# EAGLE design Qwiic_Mux_PCA9846 (EAGLE 9.6.2)
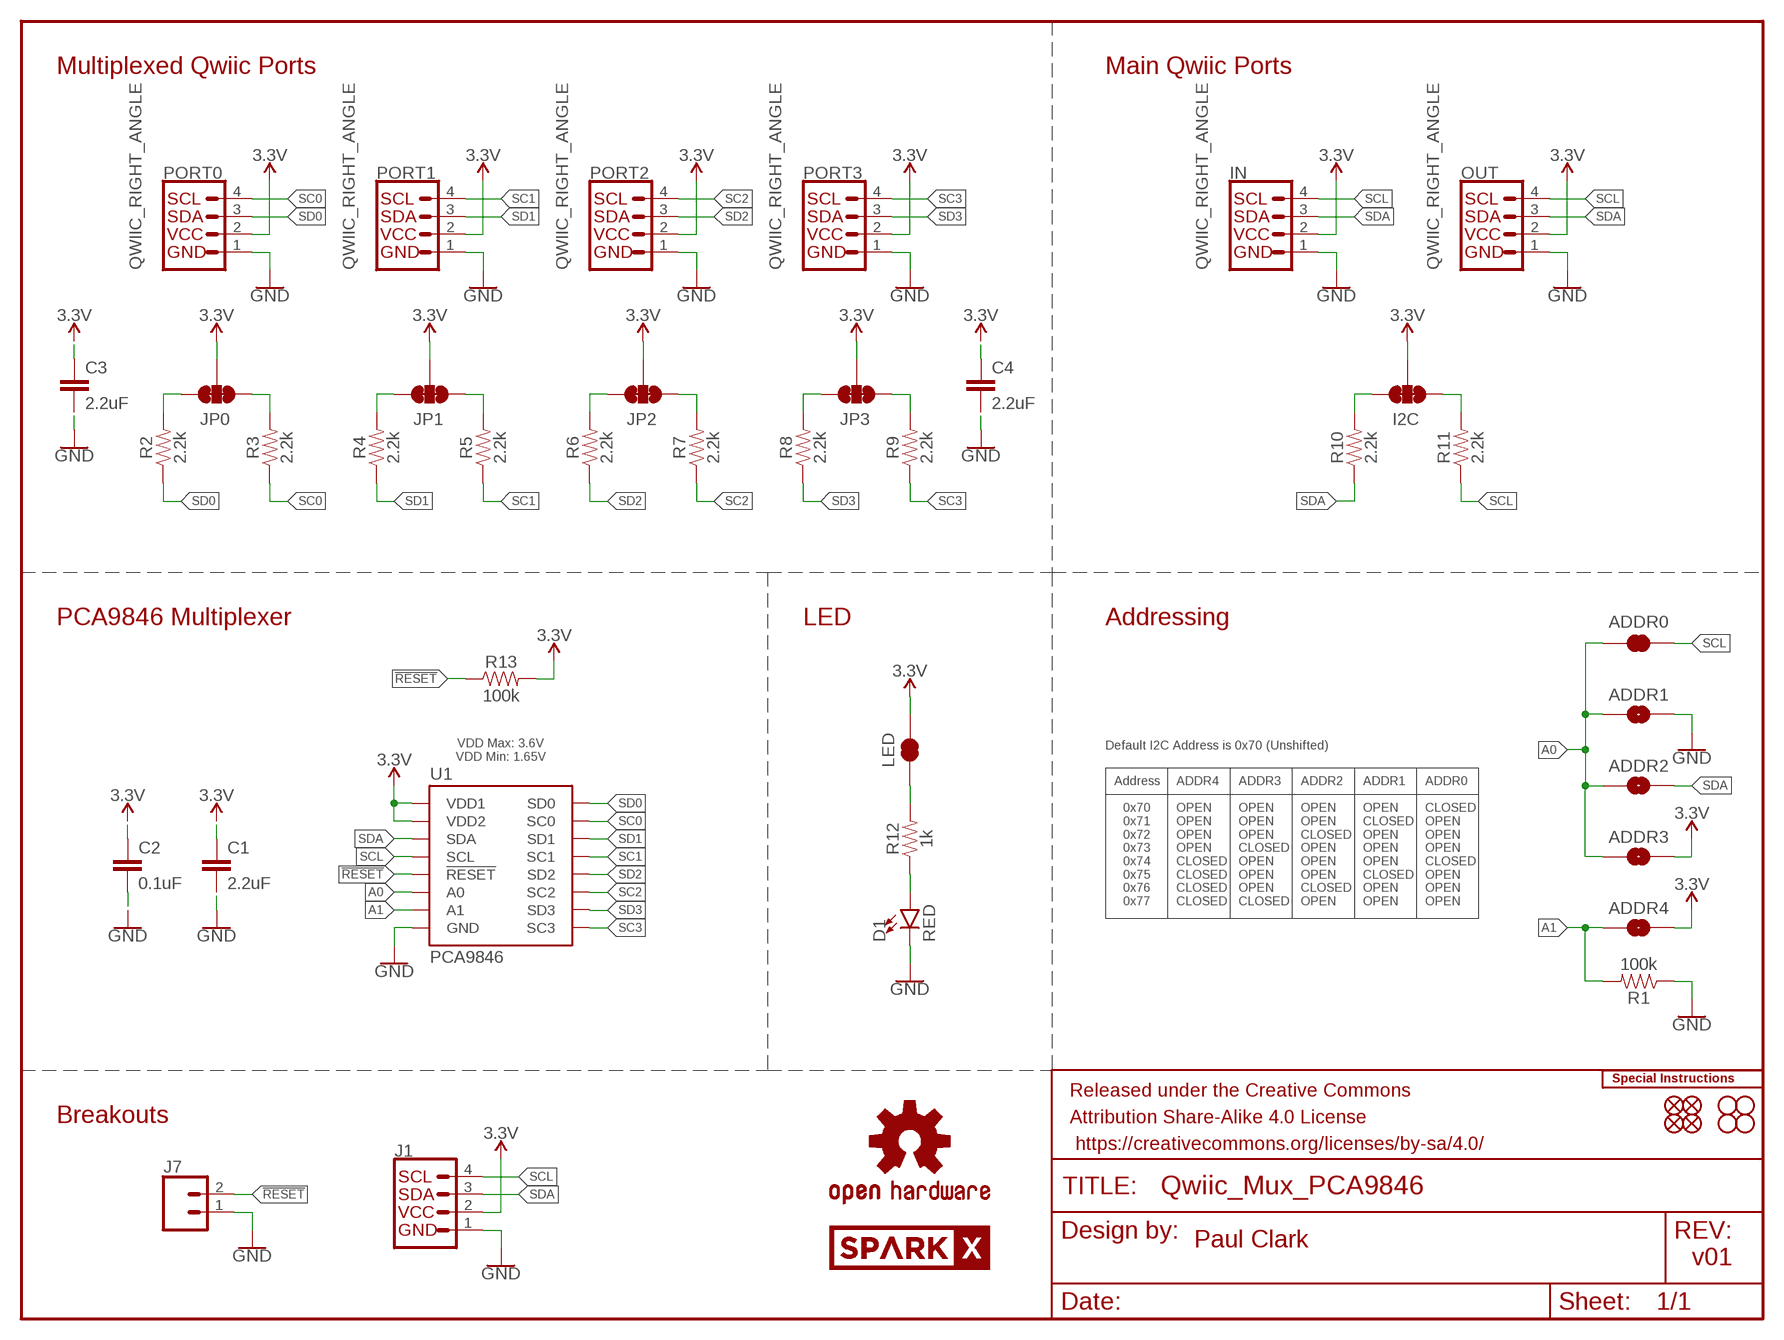
[diagram p0: schematic, sheet 1]

## Parts
ADDR0  JUMPER-SMT_2_NC_TRACE_SILK  [SMT-JUMPER_2_NC_TRACE_SILK]
ADDR1  JUMPER-SMT_2_NO_SILK  [SMT-JUMPER_2_NO_SILK]
ADDR2  JUMPER-SMT_2_NO_SILK  [SMT-JUMPER_2_NO_SILK]
ADDR3  JUMPER-SMT_2_NO_SILK  [SMT-JUMPER_2_NO_SILK]
ADDR4  JUMPER-SMT_2_NO_SILK  [SMT-JUMPER_2_NO_SILK]
C1  2.2uF  2.2UF-0402_TIGHT-10V-10%-X5R  [0402-TIGHT]
C2  0.1uF  0.1UF-0402T-6.3V-10%-X7R  [0402-TIGHT]
C3  2.2uF  2.2UF-0402_TIGHT-10V-10%-X5R  [0402-TIGHT]
C4  2.2uF  2.2UF-0402_TIGHT-10V-10%-X5R  [0402-TIGHT]
D1  RED  LED-RED0603  [LED-0603]
FD1  FIDUCIAL1X2  [FIDUCIAL-1X2]
FD2  FIDUCIAL1X2  [FIDUCIAL-1X2]
FD3  FIDUCIAL1X2  [FIDUCIAL-1X2]
FD4  FIDUCIAL1X2  [FIDUCIAL-1X2]
FRAME1  FRAME-LETTER  [CREATIVE_COMMONS]
H1  STAND-OFF  [STAND-OFF]
H2  STAND-OFF  [STAND-OFF]
H3  STAND-OFF  [STAND-OFF]
H4  STAND-OFF  [STAND-OFF]
I2C  JUMPER-SMT_3_2-NC_TRACE_SILK  [SMT-JUMPER_3_2-NC_TRACE_SILK]
IN  QWIIC_RIGHT_ANGLE  QWIIC_CONNECTORJS-1MM  [JST04_1MM_RA]
J1  I2C_STANDARD_NO_SILK  [1X04_NO_SILK]
J7  CONN_021X02_NO_SILK  [1X02_NO_SILK]
JP0  JUMPER-SMT_3_2-NC_TRACE_SILK  [SMT-JUMPER_3_2-NC_TRACE_SILK]
JP1  JUMPER-SMT_3_2-NC_TRACE_SILK  [SMT-JUMPER_3_2-NC_TRACE_SILK]
JP2  JUMPER-SMT_3_2-NC_TRACE_SILK  [SMT-JUMPER_3_2-NC_TRACE_SILK]
JP3  JUMPER-SMT_3_2-NC_TRACE_SILK  [SMT-JUMPER_3_2-NC_TRACE_SILK]
LED  JUMPER-SMT_2_NC_TRACE_SILK  [SMT-JUMPER_2_NC_TRACE_SILK]
LOGO1  SPECIAL_INSTRUCTIONS-ORDERING  [ORDERING_INSTRUCTIONS]
LOGO4  OSHW-LOGOMINI  [OSHW-LOGO-MINI]
OUT  QWIIC_RIGHT_ANGLE  QWIIC_CONNECTORJS-1MM  [JST04_1MM_RA]
PORT0  QWIIC_RIGHT_ANGLE  QWIIC_CONNECTORJS-1MM  [JST04_1MM_RA]
PORT1  QWIIC_RIGHT_ANGLE  QWIIC_CONNECTORJS-1MM  [JST04_1MM_RA]
PORT2  QWIIC_RIGHT_ANGLE  QWIIC_CONNECTORJS-1MM  [JST04_1MM_RA]
PORT3  QWIIC_RIGHT_ANGLE  QWIIC_CONNECTORJS-1MM  [JST04_1MM_RA]
R1  100k  100KOHM-0402T-1/16W-1%  [0402-TIGHT]
R2  2.2k  2.2KOHM-0402T-1/16W-1%  [0402-TIGHT]
R3  2.2k  2.2KOHM-0402T-1/16W-1%  [0402-TIGHT]
R4  2.2k  2.2KOHM-0402T-1/16W-1%  [0402-TIGHT]
R5  2.2k  2.2KOHM-0402T-1/16W-1%  [0402-TIGHT]
R6  2.2k  2.2KOHM-0402T-1/16W-1%  [0402-TIGHT]
R7  2.2k  2.2KOHM-0402T-1/16W-1%  [0402-TIGHT]
R8  2.2k  2.2KOHM-0402T-1/16W-1%  [0402-TIGHT]
R9  2.2k  2.2KOHM-0402T-1/16W-1%  [0402-TIGHT]
R10  2.2k  2.2KOHM-0402T-1/16W-1%  [0402-TIGHT]
R11  2.2k  2.2KOHM-0402T-1/16W-1%  [0402-TIGHT]
R12  1k  1KOHM-0402T-1/16W-1%  [0402-TIGHT]
R13  100k  100KOHM-0402T-1/16W-1%  [0402-TIGHT]
U1  PCA9846  [SOT403-1]
U$1  SPARKX-LOGO3  [SPARKX-SMALL]

## Nets
3.3V: ADDR3.2 ADDR4.2 C1.1 C2.1 C3.1 C4.1 I2C.2 IN.2 J1.2 JP0.2 JP1.2 JP2.2 JP3.2 LED.2 OUT.2 PORT0.2 PORT1.2 PORT2.2 PORT3.2 R13.2 U1.1(VDD1) U1.16(VDD2)
!RESET!: J7.2 R13.1 U1.3(!RESET)
A0: ADDR0.1 ADDR1.1 ADDR2.1 ADDR3.1 U1.2(A0)
A1: ADDR4.1 R1.2 U1.13(A1)
GND: ADDR1.2 C1.2 C2.2 C3.2 C4.2 D1.C IN.1 J1.1 J7.1 OUT.1 PORT0.1 PORT1.1 PORT2.1 PORT3.1 R1.1 U1.8(GND)
N$1: JP0.3 R2.2
N$2: JP0.1 R3.2
N$3: JP1.3 R4.2
N$4: JP1.1 R5.2
N$5: JP2.3 R6.2
N$6: JP2.1 R7.2
N$7: JP3.3 R8.2
N$8: JP3.1 R9.2
N$9: I2C.3 R10.2
N$10: I2C.1 R11.2
N$11: LED.1 R12.2
N$12: D1.A R12.1
SC0: PORT0.4 R3.1 U1.5(SC0)
SC1: PORT1.4 R5.1 U1.7(SC1)
SC2: PORT2.4 R7.1 U1.10(SC2)
SC3: PORT3.4 R9.1 U1.12(SC3)
SCL: ADDR0.2 IN.4 J1.4 OUT.4 R11.1 U1.14(SCL)
SD0: PORT0.3 R2.1 U1.4(SD0)
SD1: PORT1.3 R4.1 U1.6(SD1)
SD2: PORT2.3 R6.1 U1.9(SD2)
SD3: PORT3.3 R8.1 U1.11(SD3)
SDA: ADDR2.2 IN.3 J1.3 OUT.3 R10.1 U1.15(SDA)

## Notes on the sheet
- Multiplexed Qwiic Ports | Main Qwiic Ports
- PCA9846 Multiplexer | LED | Addressing
- VDD Max: 3.6V
  VDD Min: 1.65V
- Default I2C Address is 0x70 (Unshifted)
- Address | ADDR4 | ADDR3 | ADDR2 | ADDR1 | ADDR0
- 0x70
  0x71
  0x72
  0x73
  0x74
  0x75
  0x76
  0x77
- OPEN
  OPEN
  OPEN
  OPEN
  CLOSED
  CLOSED
  CLOSED
  CLOSED
- OPEN
  OPEN
  OPEN
  CLOSED
  OPEN
  OPEN
  OPEN
  CLOSED
- OPEN
  OPEN
  CLOSED
  OPEN
  OPEN
  OPEN
  CLOSED
  OPEN
- OPEN
  CLOSED
  OPEN
  OPEN
  OPEN
  CLOSED
  OPEN
  OPEN
- CLOSED
  OPEN
  OPEN
  OPEN
  CLOSED
  OPEN
  OPEN
  OPEN
- Breakouts
- Paul Clark
- v01

## Library data of the parts
ADDR0 LED = SparkFun-Jumpers:JUMPER-SMT_2_NC_TRACE: Normally closed trace jumper This jumper has a trace between two pads so it's normally closed (NC). Use a razor knife to open the connection. For best results follow the IPC guidelines for cutting traces: Cutout at least 0.063 mm (0.005 in). Remove all loose material to clean up the cut area. Seal the cut with an approved epoxy. Reapply solder to reclose the connection.
ADDR1-ADDR4 = SparkFun-Jumpers:JUMPER-SMT_2_NO: Normally open jumper This jumper has two pads in close proximity to each other. Apply solder to close the connection. Round pads are easier to solder for beginners, but are a lot larger. SparkFun Product that uses the round pads: SparkFun EL Sequencer <https://www.sparkfun.com/products/12781>
C1 C3 C4 = SparkFun-Capacitors:2.2UF: 2.2µF ceramic capacitors A capacitor is a passive two-terminal electrical component used to store electrical energy temporarily in an electric field.; PROD_ID: CAP-14232
C2 = SparkFun-Capacitors:0.1UF: 0.1µF ceramic capacitors A capacitor is a passive two-terminal electrical component used to store electrical energy temporarily in an electric field.; PROD_ID: CAP-14993
D1 = SparkFun-LED:LED-RED: Red SMD LED Used in manufacturing of most products at SparkFun Packages: 0603 - KB - KingBright (DIO-17976) SMD 0603 package [Datasheet] <https://www.kingbrightusa.com/images/catalog/SPEC/APT1608SURCK.pdf> 0603 - (DIO-00819, has gone EOL) SMD 0603 package 0603 SMART - SMD 0603 SMART package ( more efficient and expensive)[Product Link] <http://www.osram-os.com/Graphics/XPic2/00077099_0.pdf> 1206 - SMD1206 package [Product Link] <https://www.sparkfun.com/datasheets/DevTools/LilyPad/Q150OVS4.pdff> SparkFun Products: Pro Mini 328 -5V <https://www.sparkfun.com/products/821> RedBoard <https://www.sparkfun.com/products/12757> IOIO-OTG <https://www.sparkfun.com/products/13613>; PROD_ID: DIO-00819
FD1-FD4 = SparkFun-Aesthetics:FIDUCIAL: Fiducial Alignment Points Point-of-reference for pick-and-place machines and other optical instruments.
FRAME1 = SparkFun-Aesthetics:FRAME-LETTER: Schematic Frame - Letter Standard 8.5x11 US Letter frame
H1-H4 = SparkFun-Hardware:STAND-OFF: Stand Off Drill holes for mechanically mounting via screws, standoffs, etc. Note: Use the keepout ring to avoid running the screw head into surrounding components. Variant Overviews STAND-OFF - Mechanical footprint for a #4 phillips button head screw. STAND-OFF-TIGHT - Mechanical footprint for a #4 phillips button head screw, Example SparkFun Products Screw - Phillips Head (1/4", 4-40, 10 pack) <https://www.sparkfun.com/products/10453> (PRT-10453) Screw - Phillips Head (1/2", 4-40, 10 pack) <https://www.sparkfun.com/products/10452> (PRT-10452) Screw - Phillips Head (3/4", 4-40, 10 pack) <https://www.sparkfun.com/products/10451> (PRT-10451) Screw - Phillips Head (1", 4-40, 10 pack) <https://www.sparkfun.com/products/10450> (PRT-10450)
I2C JP0 JP1-JP3 = SparkFun-Jumpers:JUMPER-SMT_3_2-NC_TRACE: Normally closed trace jumper (2 of 2 connections) This jumper has a trace between all three pads so they are normally closed (NC). Use a razor knife to open the connection(s). For best results follow the IPC guidelines for cutting traces: Cutout at least 0.063 mm (0.005 in). Remove all loose material to clean up the cut area. Seal the cut with an approved epoxy. Reapply solder to reclose the connection(s).
IN OUT PORT0 PORT1-PORT3 = SparkFun-Connectors:QWIIC_CONNECTOR: SparkFun I2C Standard Qwiic Connector An SMD 1mm pitch JST connector makes it easy and quick (get it? Qwiic?) to connect I2C devices to each other. The Qwiic system <http://www.sparkfun.com/qwiic> enables fast and solderless connection between popular platforms and various sensors and actuators. We carry 200mm <https://www.sparkfun.com/products/14204>, 100mm <https://www.sparkfun.com/products/14205>, 50mm <https://www.sparkfun.com/products/14206>, and breadboard friendly <https://www.sparkfun.com/products/14207> Qwiic cables. We also offer 10 pcs strips <https://www.sparkfun.com/products/14323> the SMD connectors.; PROD_ID: CONN-13694
J1 = SparkFun-Connectors:I2C_STANDARD: SparkFun I2C Standard Pinout Header SparkFun has standardized on a pinout for all I2C based sensor breakouts. This pinout allows I2C boards to be plugged directly into the headers on Arduino Uno compatible boards, and to be daisy chained easily. Example SparkFun Products: SparkFun Atmospheric Sensor Breakout - BME280 <https://www.sparkfun.com/products/13676> SparkFun Altitude/Pressure Sensor Breakout - MPL3115A2 <https://www.sparkfun.com/products/11084> SparkFun TOF Range Finder Sensor - VL6180 <https://www.sparkfun.com/products/12785>
J7 = SparkFun-Connectors:CONN_02: Multi connection point. Often used as Generic Header-pin footprint for 0.1 inch spaced/style header connections On any of the 0.1 inch spaced packages, you can populate with these: Break Away Headers - Straight <https://www.sparkfun.com/products/116> (PRT-00116) Break Away Male Headers - Right Angle <https://www.sparkfun.com/products/553> (PRT-00553) Female Headers <https://www.sparkfun.com/products/115> (PRT-00115) Break Away Headers - Machine Pin <https://www.sparkfun.com/products/117> (PRT-00117) Break Away Female Headers - Swiss Machine Pin <https://www.sparkfun.com/products/743> (PRT-00743) For SCREWTERMINALS and SPRING TERMINALS visit here: Screw Terimnals on SparkFun.com <https://www.sparkfun.com/search/results?term=Screw+Terminals> (5mm/3.5mm/2.54mm spacing) This device is also useful as a general connection point to wire up your design to another part of your project. Our various solder wires solder well into these plated through hole pads. Hook-Up Wire - Assortment (Stranded, 22 AWG) <https://www.sparkfun.com/products/11375> (PRT-11375) Hook-Up Wire - Assortment (Solid Core, 22 AWG) <https://www.sparkfun.com/products/11367> (PRT-11367) View the entire wire category on our website here <https://www.sparkfun.com/categories/141> Special notes: Molex polarized connector foot print use with: PRT-08233 with associated crimp pins and housings. 2.54_SCREWTERM for use with PRT-10571. 3.5mm Screw Terminal footprints for PRT-08084 5mm Screw Terminal footprints for use with PRT-08432
LOGO1 = SparkFun-Aesthetics:SPECIAL_INSTRUCTIONS: Special Ordering/Production Instructions Alert Symbol for special PCB ordering instructions or unique production process warnings. Ordering Instructions Production Instructions Types of information that should be added to box: Copper weight Soldermask color Silk color PCB thickness Number of layers PCB Standard: 1.6mm FR4 1 oz copper immersion silver plating red soldermask white silkscreen Types of information that should be added to box: Special wash requirements Depaneling instructions Humidification Glue curing Default text settings: 0.07 inch 9% ratio 50% line distance
LOGO4 = SparkFun-Aesthetics:OSHW-LOGO: Open-Source Hardware (OSHW) Logo This logo indicates the piece of hardware it is found on incorporates a OSHW license and/or adheres to the definition of open source hardware found here: http://freedomdefined.org/OSHW
R1 R13 = SparkFun-Resistors:100KOHM: 100kΩ resistor A resistor is a passive two-terminal electrical component that implements electrical resistance as a circuit element. Resistors act to reduce current flow, and, at the same time, act to lower voltage levels within circuits. - Wikipedia; PROD_ID: RES-13495
R2-R11 = SparkFun-Resistors:2.2KOHM: 2.2kΩ resistor A resistor is a passive two-terminal electrical component that implements electrical resistance as a circuit element. Resistors act to reduce current flow, and, at the same time, act to lower voltage levels within circuits. - Wikipedia; PROD_ID: RES-14341
R12 = SparkFun-Resistors:1KOHM: 1kΩ resistor A resistor is a passive two-terminal electrical component that implements electrical resistance as a circuit element. Resistors act to reduce current flow, and, at the same time, act to lower voltage levels within circuits. - Wikipedia; PROD_ID: RES-14342
U1 = SparkFun-IC-Logic:PCA9846: NXP Semiconductors PCA9846 - I2C Multiplexer The PCA9846 device has four bidirectional translating switches that can be controlled through the I2C bus. The SCL/SDA upstream pair fans out to four downstream pairs, or channels. Any individual SCn/SDn channel or combination of channels can be selected, determined by the contents of the programmable control register. These downstream channels can be used to resolve I2C address conflicts.; PROD_ID: IC-18372
U$1 = SparkX:SPARKX-LOGO

## Board
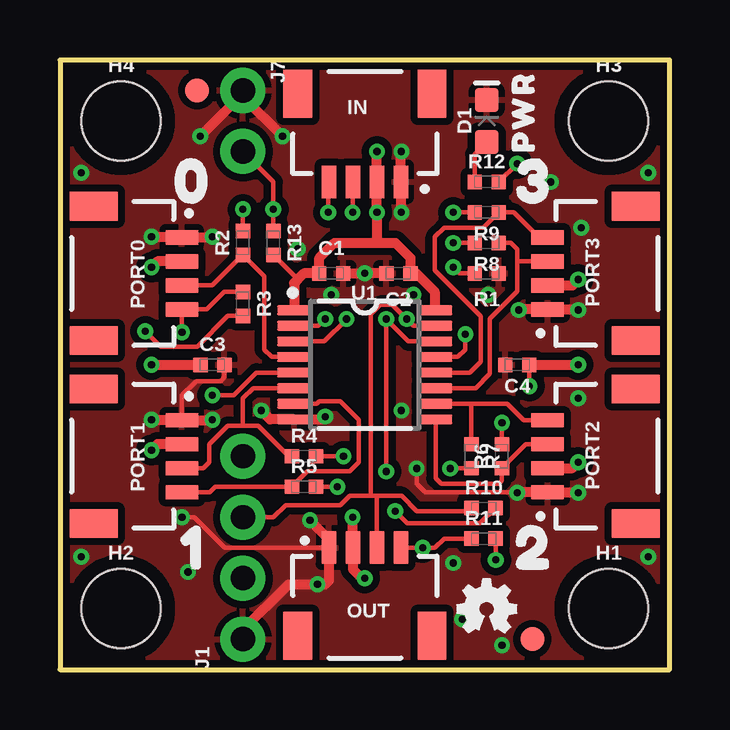
[diagram p1: board, top side]
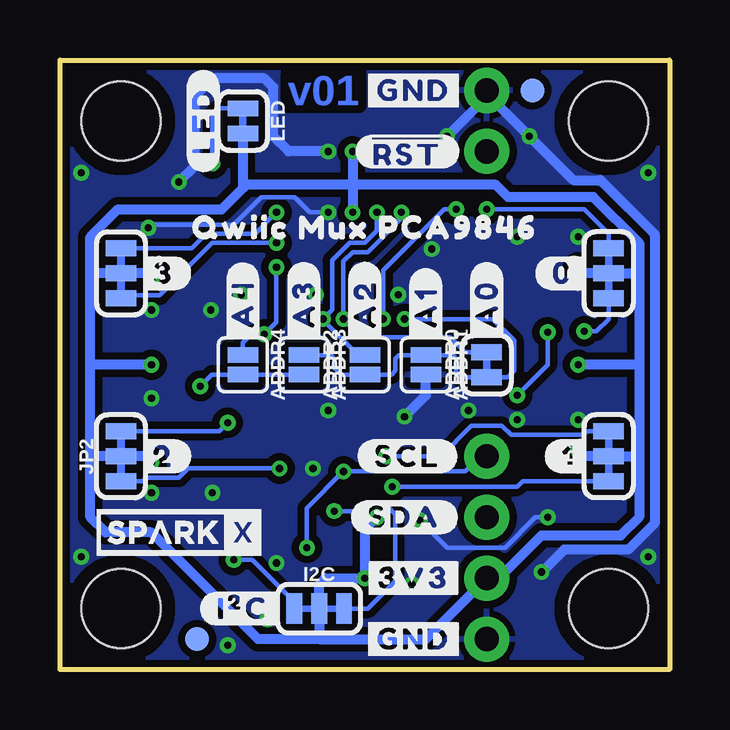
[diagram p2: board, bottom side, seen from below]

Size 25.4 x 25.4 mm. Coordinates in mm from the lower left corner, seen from the top.
Outline: 0,0 25.4,0 25.4,25.4 0,25.4 0,0
Copper layers (1*16): Top 0.035mm / dielectric 1.5mm / Bottom 0.035mm
Design rules "SparkFun-2-Layer-General-JLCPCB": minimum track width 7mil, minimum drill 0.3mm, track to track 7mil, track to pad 7mil, pad to pad 7mil, via to via 7mil, smd to smd 7mil, copper to edge 7mil, drill to drill 7mil, minimum pad ring 7mil, minimum via ring 7mil, stop-mask expansion 3mil, vias tented up to drill 25mil, thermal gap 10mil

### Footprints (pad centres in the part's own frame; a part is rotated, then mirrored left to right if it is on the bottom)
SMT-JUMPER_2_NC_TRACE_SILK = smd 0.66 x 1.27: 1 -0.521,0; 2 0.521,0
SMT-JUMPER_2_NO_SILK = smd 0.635 x 1.27: 1 -0.406,0; 2 0.406,0
0402-TIGHT = smd 0.6 x 0.6: 1 -0.5,0; 2 0.5,0
LED-0603 = smd 1 x 1: A -0.877,0; C 0.877,0
FIDUCIAL-1X2 = smd 1 x 1: 1 0,0
STAND-OFF = hole 3.302: 0,0
SMT-JUMPER_3_2-NC_TRACE_SILK = smd 0.66 x 1.27: 1 -1.041,0; 2 0,0; 3 1.041,0
JST04_1MM_RA = smd 0.6 x 1.35: 1 -1.5,0; 2 -0.5,0; 3 0.5,0; 4 1.5,0 | smd 1.2 x 2: NC1 2.8,-3.675; NC2 -2.8,-3.675
1X04_NO_SILK = drill 1.016 pad 1.88: 1 0,0; 2 2.54,0; 3 5.08,0; 4 7.62,0
1X02_NO_SILK = drill 1.016 pad 1.88: 1 0,0; 2 2.54,0
SOT403-1 = smd 0.4 x 1.4: 1 -2.275,-2.95; 2 -1.625,-2.95; 3 -0.975,-2.95; 4 -0.325,-2.95; 5 0.325,-2.95; 6 0.975,-2.95; 7 1.625,-2.95; 8 2.275,-2.95; 9 2.275,2.95; 10 1.625,2.95; 11 0.975,2.95; 12 0.325,2.95; 13 -0.325,2.95; 14 -0.975,2.95; 15 -1.625,2.95; 16 -2.275,2.95

### Placement (x,y rotation side)
ADDR0  7.62,12.7 90 bottom
ADDR1  10.16,12.7 270 bottom
ADDR2  12.7,12.7 90 bottom
ADDR3  15.24,12.7 270 bottom
ADDR4  17.78,12.7 270 bottom
C1  11.3,16.51 0 top
C2  14.1,16.51 180 top
C3  6.35,12.7 0 top
C4  19.05,12.7 180 top
D1  17.78,22.86 90 top
FD1  5.71,24.13 0 top
FD2  19.68,1.27 0 top
FD3  5.71,24.13 0 bottom
FD4  19.68,1.27 0 bottom
FRAME1  59.69,-13.97 0 top  (outside the outline)
H1  22.86,2.54 0 top
H2  2.54,2.54 0 top
H3  22.86,22.86 0 top
H4  2.54,22.86 0 top
I2C  14.61,2.54 0 bottom
IN  12.7,20.32 180 top
J1  7.62,1.27 90 top
J7  7.62,24.13 270 top
JP0  2.54,16.51 90 bottom
JP1  2.54,8.89 90 bottom
JP2  22.86,8.89 90 bottom
JP3  22.86,16.51 270 bottom
LED  17.78,22.86 270 bottom
LOGO1  36.83,46.99 0 top  (outside the outline)
LOGO4  17.78,2.54 0 top
OUT  12.7,5.08 0 top
PORT0  5.08,16.51 270 top
PORT1  5.08,8.89 270 top
PORT2  20.32,8.89 90 top
PORT3  20.32,16.51 90 top
R1  17.78,16.51 180 top
R2  7.62,17.78 90 top
R3  7.62,15.24 270 top
R4  10.16,8.89 0 top
R5  10.16,7.62 0 top
R6  18.41,8.89 90 top
R7  17.14,8.89 270 top
R8  17.78,17.78 180 top
R9  17.78,19.05 180 top
R10  17.65,6.73 0 top
R11  17.65,5.46 0 top
R12  17.78,20.32 0 top
R13  8.89,17.78 270 top
U1  12.7,12.7 270 top
U$1  20.45,5.71 0 bottom
U$2  [PWR43214]  19.3,23.24 90 top
U$3  [043215]  5.59,20.32 0 top
U$4  [10]  5.59,5.08 0 top
U$5  [211]  19.81,5.08 0 top
U$6  [3212]  19.81,20.32 0 top
U$7  [##RST##8]  10.92,21.59 0 bottom
U$8  [#0#9]  4.45,16.51 0 bottom
U$9  [#1#9]  4.19,8.89 0 bottom
U$10  [#2#9]  21.08,8.89 0 bottom
U$11  [#3#9]  21.08,16.51 0 bottom
U$12  [#3V3#7]  10.67,3.81 0 bottom
U$13  [#A0#0]  7.62,15.24 90 bottom
U$14  [#A1#1]  10.16,15.11 90 bottom
U$15  [#A2#2]  12.7,15.24 90 bottom
U$16  [#A3#3]  15.24,15.24 90 bottom
U$17  [#A4#4]  17.78,15.24 90 bottom
U$18  [#GND#7]  10.67,1.27 0 bottom
U$19  [#GND#7]  10.67,24.13 0 bottom
U$21  [#SCL#5]  10.92,8.89 0 bottom
U$22  [#SDA#6]  11.05,6.35 0 bottom
U$23  [#LED#0]  19.43,22.86 90 bottom
U$24  [QWIIC_MUX_PCA98461]  12.7,18.41 0 bottom
U$25  [#I�C#0]  17.78,2.54 0 bottom

### Tracks (layer width: path | path; a pad name or v marks a point on that pad's centre or on a via)
3.3V  (via drill 0.3)
  Top 0.178: v19.56,11.81 v19.55,11.82 C4.1 | R13.2 9.91,16.26
  Top 0.406: PORT0.2 4.06,17.01 v3.81,16.76 | PORT1.2 4.06,9.39 v3.81,9.14 | PORT2.2 21.34,8.39 v21.59,8.64 | PORT3.2 21.34,16.01 v21.59,16.26 | v12.19,6.35 v12.2,6.34 OUT.2 12.2,4.19 12.58,3.81 v12.7,3.81 | v13.21,21.59 v13.2,21.58 IN.2 v13.2,19.06 v13.21,19.05 13.21,17.78 | v3.81,12.7 C3.1 | C4.1 v21.59,12.7 | U1.1 9.75,16.1 9.91,16.26 10.16,16.51 C1.1 10.8,17.15 11.43,17.78 13.21,17.78 | U1.16 15.61,14.97 15.61,15.75 14.85,16.51 C2.1 14.6,17.15 13.97,17.78 13.21,17.78
  Bottom 0.178: ADDR3.2 ADDR4.2 19.07,12.29 v19.56,11.81
  Bottom 0.406: 14.61,1.27 I2C.2 14.61,3.56 14.35,3.81 v12.7,3.81 12.7,5.84 v12.19,6.35 | 14.61,1.27 10.16,1.27 J1.2 7.11,3.81 5.33,5.59 2.03,5.59 1.27,6.35 1.27,8.89 | 1.27,16.51 1.27,17.78 3.17,19.68 6.73,19.68 7.24,20.19 13.21,20.19 | 1.27,16.51 1.27,12.7 | 1.27,12.7 1.27,8.89 | v3.81,16.76 3.56,16.51 JP0.2 1.27,16.51 | v3.81,9.14 3.56,8.89 JP1.2 1.27,8.89 | 14.61,1.27 17.14,1.27 21.59,5.71 23.5,5.71 24.13,6.35 24.13,8.89 | v21.59,8.64 21.84,8.89 JP2.2 24.13,8.89 | 24.13,8.89 24.13,12.7 | 24.13,12.7 24.13,16.51 | 24.13,16.51 24.13,18.03 22.99,19.18 18.67,19.18 17.78,20.07 | v21.59,16.26 21.84,16.51 JP3.2 24.13,16.51 | v13.21,21.59 13.21,20.19 | 13.21,20.19 v13.21,19.05 | 13.21,20.19 17.65,20.19 17.78,20.07 | LED.2 17.78,20.07 | 1.27,12.7 v3.81,12.7 | v21.59,12.7 24.13,12.7
!RESET!  (via drill 0.3)
  Top 0.178: U1.3 11.01,13.68 v11.94,14.61 | J7.2 8.89,20.32 v8.89,19.18 R13.1
  Bottom 0.178: v11.94,14.61 11.94,16.64 9.4,19.18 v8.89,19.18
A0  (via drill 0.3)
  Top 0.178: v11.05,14.61 10.77,14.32 U1.2
  Bottom 0.178: ADDR3.1 14.12,13.11 13.97,12.95 13.97,12.57 13.69,12.29 ADDR2.1 11.58,12.29 11.43,12.45 11.43,12.95 11.28,13.11 ADDR1.1 9.04,13.11 8.89,12.95 8.89,12.32 8.75,12.18 ADDR0.1 6.74,12.18 6.48,12.45 6.48,13.72 7.37,14.61 v11.05,14.61
A1  (via drill 0.3)
  Top 0.178: U1.13 16.58,13.03 16.89,13.34 v16.89,13.97 | R1.2 16.64,16.51 v16.38,16.76
  Bottom 0.178: ADDR4.1 17.78,13.61 17.42,13.97 v16.89,13.97 16.38,14.48 v16.38,16.76
GND  (via drill 0.3)
  Top 0.178: PORT1.1 5.08,11.43 5.67,12.02 6.69,12.02 6.85,12.18 C3.2 | v5.08,6.35 5.59,6.35 6.86,5.08 OUT.1 | v14.86,8.38 14.86,7.75 15.21,7.39 19.07,7.39
  Top 0.406: v14.22,21.59 14.2,21.57 IN.1 14.2,19.07 v14.22,19.05 | v3.81,18.03 3.83,18.01 PORT0.1 6.33,18.01 v6.35,18.03 | v19.11,14.99 19.14,15.01 PORT3.1 21.57,15.01 v21.59,14.99 | v19.05,7.37 19.07,7.39 PORT2.1 21.57,7.39 v21.59,7.37 | v3.81,10.41 3.83,10.39 PORT1.1 6.33,10.39 v6.35,10.41 | v10.41,6.22 11.2,5.44 OUT.1 11.2,3.71 11.05,3.56 v10.73,3.56 9.53,3.56 7.62,1.65 J1.1 | v11.05,10.54 10.93,10.43 U1.8 8.75,10.43 v8.38,10.79 | C1.2 v12.7,16.51 C2.2 | v5.84,22.23 7.62,24 J7.1 7.62,23.88 v9.27,22.23
  Bottom 0.178: v5.08,6.35 5.59,6.35 6.86,5.08 9.27,5.08 v10.41,6.22 | v14.22,19.05 14.99,19.05 15.62,19.68 17.02,19.68 18.16,18.54 21.59,18.54 v21.72,18.41
  Bottom 0.406: v11.05,10.54 10.16,11.43 ADDR1.2 | v5.33,4.06 4.39,5 1.73,5 0.62,6.11 0.62,18.15 2.87,20.4 4.01,20.4 v5.84,22.23 7.62,24 J7.1 7.62,23.88 v9.27,22.23 | v14.22,21.59 15.88,21.59 16.51,22.23 16.51,24.26 16.89,24.64 19.05,24.64 19.81,23.88 19.81,20.95 v20.45,20.32
  other vias: 17.84,15.62 11.3,15.62 9.91,17.53 14.22,10.79 16.38,4.45 18.41,1.02 16.76,2.1 21.59,11.3 14.73,15.62 0.89,20.7 24.51,20.7 24.51,4.7 0.89,4.7
  pour Top (isolate 0.305): 0,25.4 0,0 25.4,0 25.4,25.4
  pour Bottom (isolate 0.305): 0,25.4 0,0 25.4,0 25.4,25.4
N$1  (via drill 0.3)
  Top 0.178: v7.62,19.18 R2.2
  Bottom 0.178: JP0.3 2.54,18.16 3.56,19.18 v7.62,19.18
N$2  (via drill 0.3)
  Top 0.178: R3.2 6.99,14.74 5.71,13.46 4.19,13.46 v3.56,14.1
  Bottom 0.178: v3.56,14.1 3.05,14.1 2.54,14.61 JP0.1
N$3  (via drill 0.3)
  Top 0.178: R4.2 v11.81,8.89
  Bottom 0.178: v11.81,8.89 9.53,8.89 8.26,10.16 6.99,10.16 6.6,9.78 3.6,9.78 3.45,9.93 JP1.3
N$4  (via drill 0.3)
  Top 0.178: R5.2 v11.56,7.62
  Bottom 0.178: v11.56,7.62 6.35,7.62 6.12,7.85 JP1.1
N$5  (via drill 0.3)
  Top 0.178: R6.2 v18.41,10.29
  Bottom 0.178: v18.41,10.29 18.77,9.93 JP2.3
N$6  (via drill 0.3)
  Top 0.178: R7.2 v16.26,8.39 v16.26,8.38
  Bottom 0.178: v16.26,8.38 20.07,8.38 20.45,8 21.8,8 21.95,7.85 JP2.1
N$7  (via drill 0.3)
  Top 0.178: R8.2 v16.38,17.78
  Bottom 0.178: JP3.3 22.73,15.6 21.23,15.6 19.05,17.78 v16.38,17.78
N$8  (via drill 0.3)
  Top 0.178: R9.2 v16.38,19.05
  Bottom 0.178: v16.38,19.05 17.27,18.16 19.3,18.16 19.91,17.55 JP3.1
N$9  (via drill 0.3)
  Top 0.178: R10.2 18.13,6.73 17.5,6.1 14.48,6.1 v13.97,6.6
  Bottom 0.178: I2C.3 12.57,2.54 11.43,3.68 11.43,6.48 11.9,6.94 12.49,6.94 12.83,6.6 v13.97,6.6
N$10  (via drill 0.3)
  Top 0.178: v18.16,4.57 v18.15,4.58 R11.2
  Bottom 0.178: I2C.1 15.65,2.82 17.4,4.57 v18.16,4.57
N$11  (via drill 0.3)
  Top 0.178: R12.2 v19.05,21.08
  Bottom 0.178: LED.1 18.78,23.38 19.05,23.11 v19.05,21.08
N$12
  Top 0.178: D1.A 17.28,21.48 R12.1
SC0  (via drill 0.3)
  Top 0.178: R3.1 6.85,15.74 6.12,15.01 PORT0.4 v5.08,14.06 | v6.35,11.43 7.24,11.43 8.18,12.38 U1.5
  Bottom 0.178: v5.08,14.06 5.08,12.7 v6.35,11.43
SC1
  Top 0.178: PORT1.4 6.25,7.39 6.48,7.62 R5.1 10.29,8.26 12.06,8.26 12.45,8.64 12.45,10.41 11.68,11.18 10.79,11.18 10.69,11.07 U1.7
SC2
  Top 0.178: U1.10 17.14,11.07 | 17.14,11.07 18.64,11.07 19.33,10.39 PORT2.4 | R7.1 17.14,11.07
SC3
  Top 0.178: PORT3.4 19.94,18.01 18.9,19.05 R9.1 17.64,18.41 16,18.41 15.62,18.03 15.62,16.64 17.53,14.73 17.53,12.83 17.07,12.38 U1.12
SCL  (via drill 0.3)
  Top 0.178: U1.14 14.52,13.68 v13.59,14.61 v13.59,8.26 | v11.18,19.05 11.18,20.3 IN.4 | R11.1 16,5.46 15.62,5.08 v15.11,5.08 OUT.4
  Bottom 0.178: v11.18,19.05 11.18,18.8 12.57,17.4 13.21,17.4 13.59,17.02 v13.59,14.61 12.83,13.84 9.14,13.84 8.52,13.22 ADDR0.2 | J1.4 7.87,8.89 8.51,8.26 v13.59,8.26 15.11,6.73 v15.11,5.08
SD0
  Top 0.178: PORT0.3 6.35,16.01 R2.1 8.51,16.39 8.51,13.34 8.82,13.03 U1.4
SD1
  Top 0.178: PORT1.3 5.98,8.39 6.22,8.64 6.22,9.4 6.99,10.16 7.62,10.16 | R4.1 9.53,8.89 8.26,10.16 7.62,10.16 | U1.6 8.04,11.72 7.62,11.3 7.62,10.16
SD2
  Top 0.178: U1.9 15.65,7.97 15.88,7.75 18.29,7.75 18.41,7.87 R6.1 19.41,9.39 PORT2.3
SD3
  Top 0.178: R8.1 18.78,17.78 19.05,17.51 19.05,17.02 | U1.11 17.31,11.72 17.91,12.32 17.91,14.62 19.05,15.76 19.05,17.02 | 19.05,17.02 19.06,17.01 PORT3.3
SDA  (via drill 0.3)
  Top 0.178: U1.15 14.72,14.32 v14.44,14.61 13.85,15.2 13.34,15.2 12.95,14.81 12.95,7.24 | v12.19,19.05 IN.3 | R10.1 17.03,6.6 14.87,6.6 14.23,7.24 13.21,7.24 | J1.3 8.89,6.35 9.4,6.86 11.68,6.86 12.06,7.24 12.95,7.24 | 13.21,7.24 12.95,7.24 | OUT.3 13.2,7.23 13.21,7.24
  Bottom 0.178: v12.19,19.05 12.19,18.29 12.7,17.78 13.34,17.78 14.06,17.05 14.06,14.99 v14.44,14.61 14.44,14.57 12.98,13.11 ADDR2.2

### Text on the board
Bottom: v01
Measures: Dimensions in Inches
tDocu: Thickness: 1.6mm / 2 Layers / Black Solder Resist / White Silkscreen / Finish: HASL Lead Free | Paul Clark